# Altium schematic sheet 04 MP_SIGNAL.SchDoc
size A4
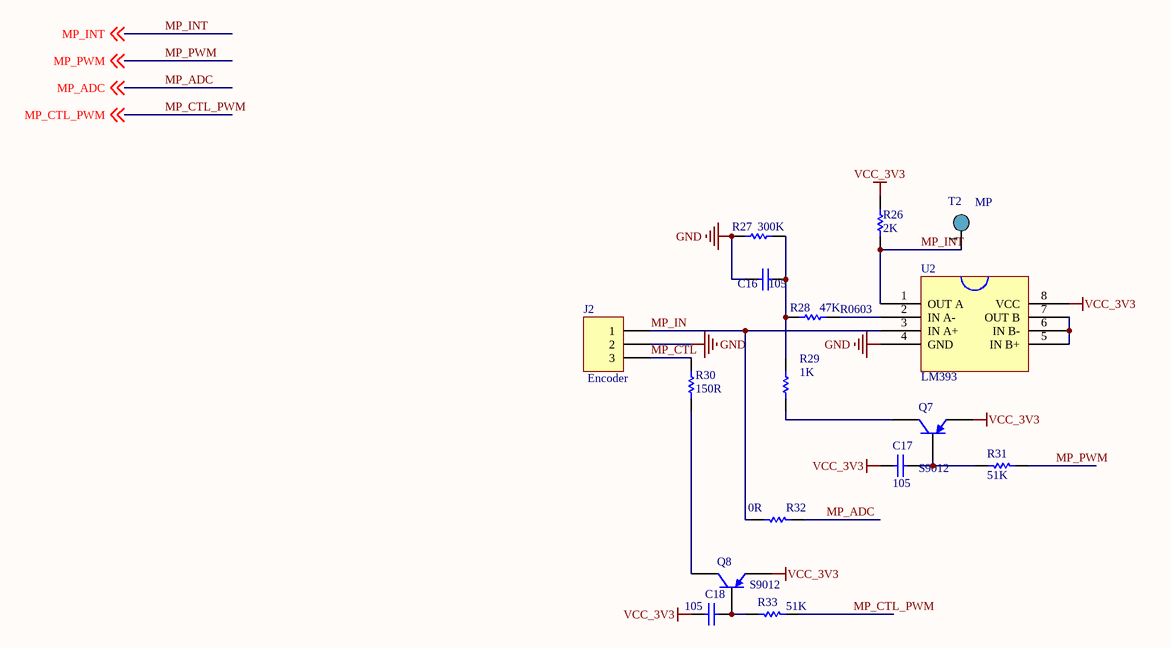
[diagram p0: 04 MP_SIGNAL.SchDoc]

## Parts
C16  105  [R0603]
C17  105  [C0603]
C18  105  [C0603]
J2  Encoder  [PH2.0*3]
Q7  S9012  [PNP-SOT-23]
Q8  S9012  [PNP-SOT-23]
R26  2K  [R0603]
R27  300K  [R0603]
R28  47K  [R0603]
R29  1K  [R0603]
R30  150R  [R0603]
R31  51K  [R0603]
R32  0R  [R0603]
R33  51K  [R0603]
T2  MP  [测试点]
U2  LM393  [LM393]

## Nets
GND: C16.1 J2.2 R27.1 U2.4(GND)
VCC_3V3: C17.1 C18.2 Q7.1(E) Q8.1(E) R26.1 U2.8(VCC)
MP_ADC: R32.1 ; off-sheet MP_ADC
MP_CTL: J2.3 R30.2
MP_CTL_PWM: R33.1 ; off-sheet MP_CTL_PWM
MP_IN: J2.1 R32.2 U2.3(IN_A+)
MP_INT: R26.2 T2.1 U2.1(OUT_A) ; off-sheet MP_INT
MP_PWM: R31.1 ; off-sheet MP_PWM
NetC16_2: C16.2 R27.2 R28.1 R29.1
NetC17_2: C17.2 Q7.2(B) R31.2
NetC18_1: C18.1 Q8.2(B) R33.2
NetQ7_3: Q7.3(C) R29.2
NetQ8_3: Q8.3(C) R30.1
NetR28_2: R28.2 U2.2(IN_A-)
NetU2_5: U2.5(IN_B+) U2.6(IN_B-) U2.7(OUT_B)

## Library data of the parts
C16-C18 = Cap: Capacitor; Manufacturer: Generic Components; Class: Passive; Published: 08/06/2000; Publisher: Altium Hobart Technology Centre; SubClass: Capacitor; Value: 105
J2 = Header 3: Header, 3-Pin; Manufacturer: Generic Components; Class: Connector
Q7 Q8 = 2N3906: PNP General Purpose Amplifier; Published: 8-Jun-2000; LatestRevisionDate: 15-Jan-2003; LatestRevisionNote: PCB Footprint 'BCY-W3/D4.7' replaced; DatasheetDocument: 1997; PackageDocument: Sep-1998; PackageReference: TO-92A; Publisher: Altium Limited; Code_JEDEC: TO-92A
R26-R30 = Res1: Resistor; Manufacturer: Generic Components; Class: Passive; Value: 5.1K; Published: 08/06/2000; Publisher: Altium Hobart Technology Centre; SubClass: Resistor
R31 R33 = Res1: Resistor; Manufacturer: Generic Components; Class: Passive; Published: 08/06/2000; Publisher: Altium Hobart Technology Centre; SubClass: Resistor; Value: 51K
R32 = Res1: Resistor; Manufacturer: Generic Components; Class: Passive; Value: 51K; Published: 08/06/2000; Publisher: Altium Hobart Technology Centre; SubClass: Resistor
T2 = DIAN